# Altium project brushless_foc.PrjPCB
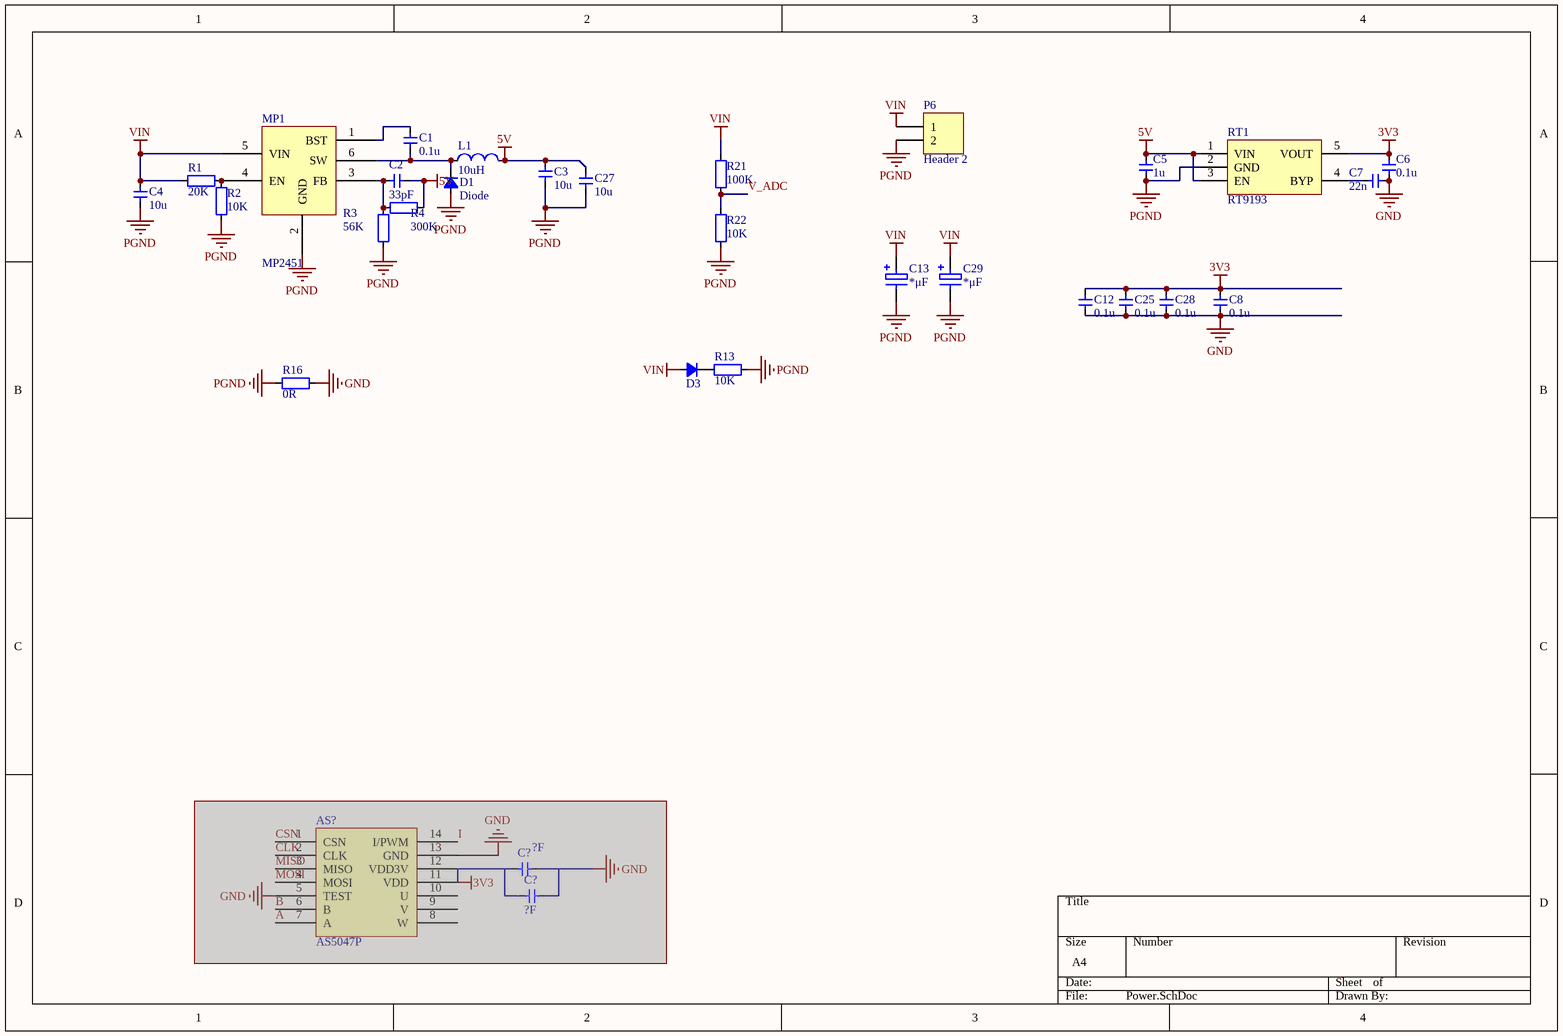
[diagram p0: Power.SchDoc]
4 sheets, 95 parts. Net scope: global (net labels, ports and power ports of the same name join across sheets).
Board file: FocPCB.PcbDoc
Sheets:
  Power.SchDoc
  MCU.SchDoc
  H_Bridge.SchDoc
  GD32MCU.SchDoc

## Sheet Power.SchDoc
size A4

### Parts
(Parts that share a designator on the sheet are numbered #1, #2 ... from top to bottom, then left to right.)
AS?  AS5047P  [AS5047P]  (masked out: inside a compile mask, not in the netlist)
C1  value 0.1u  [CAP_0603]  (hidden comment: Cap_0603)
C2  value 33pF  [CAP_0603]  (hidden comment: Cap_0603)
C3  value 10u  [CAP_0805]  (hidden comment: Cap_0805)
C4  value 10u  [CAP_0805]  (hidden comment: Cap_0805)
C5  value 1u  [CAP_0603]  (hidden comment: Cap_0603)
C6  value 0.1u  [CAP_0603]  (hidden comment: Cap_0603)
C7  value 22n  [CAP_0603]  (hidden comment: Cap_0603)
C8  value 0.1u  [CAP_0603]  (hidden comment: Cap_0603)
C12  value 0.1u  [CAP_0603]  (hidden comment: Cap_0603)
C13  *μF  [CAP-ELE-PIN150/DIA320]
C25  value 0.1u  [CAP_0603]  (hidden comment: Cap_0603)
C27  value 10u  [CAP_0805]  (hidden comment: Cap_0805)
C28  value 0.1u  [CAP_0603]  (hidden comment: Cap_0603)
C29  *μF  [CAP-ELE-PIN150/DIA320]
C?#1  value ?F  [CAP_0603]  (hidden comment: Cap_0603)  (masked out: inside a compile mask, not in the netlist)
C?#2  value ?F  [CAP_0603]  (hidden comment: Cap_0603)  (masked out: inside a compile mask, not in the netlist)
D1  Diode  [LED_0805_RED]
D3  D_0805  [LED_0805_YELLOW]  (value not drawn)
L1  value 10uH  [IND_CD52]  (hidden comment: Ind_CD32)
MP1  MP2451  [SOT23-6]
P6  Header 2  [power]
R1  value 20K  [RES_0603]  (hidden comment: Res_0603)
R2  value 10K  [RES_0603]  (hidden comment: Res_0603)
R3  value 56K  [RES_0603]  (hidden comment: Res_0603)
R4  value 300K  [RES_0603]  (hidden comment: Res_0603)
R13  value 10K  [RES_0603]  (hidden comment: Res_0603)
R16  value 0R  [RES_0603]  (hidden comment: Res_0603)
R21  value 100K  [RES_0603]  (hidden comment: Res_0603)
R22  value 10K  [RES_0603]  (hidden comment: Res_0603)
RT1  RT9193  [SOT23-5]

### Nets
3V3: C6.2 C8.2 C12.2 C25.2 C28.2 RT1.5(VOUT)
5V: C2.1 C3.2 C5.2 C27.2 L1.2 R4.2 RT1.1(VIN) RT1.3(EN)
GND: C6.1 C7.1 C8.1 C12.1 C25.1 C28.1 R16.2
PGND: C3.1 C4.1 C5.1 C13.2 C27.1 C29.2 D1.1(A) MP1.2(GND) P6.2 R2.2 R3.2 R13.2 R16.1 R22.2 RT1.2(GND)
VIN: C4.2 C13.1 C29.1 D3.1(A) MP1.5(VIN) P6.1 R1.1 R21.1
V_ADC: R21.2 R22.1
NetC1_1: C1.1 D1.2(K) L1.1 MP1.6(SW)
NetC1_2: C1.2 MP1.1(BST)
NetC2_2: C2.2 MP1.3(FB) R3.1 R4.1
NetC7_2: C7.2 RT1.4(BYP)
NetD3_2: D3.2(K) R13.1
NetMP1_4: MP1.4(EN) R1.2 R2.1

### Library data of the parts
C1 C2 C5-C8 C12 C25 C28 C?#1 C?#2 = Cap_0603: Capacitor
C3 C4 C27 = Cap_0805: Capacitor
C13 C29 = CAP-ELE: 电解电容; Published: 8-Jun-2000; LatestRevisionDate: 17-Jul-2002; LatestRevisionNote: Re-released for DXP Platform.; PackageReference: RB7.6-15; Publisher: Altium Limited; PackageDescription: Polarized Capacitor (Radial); 2 Leads; Value: *μF
L1 = Ind_CD32: Inductor
P6 = Header 2: Header, 2-Pin; LatestRevisionDate: 17-Jul-2002; LatestRevisionNote: Re-released for DXP Platform.; Publisher: Altium Limited
R1-R4 R13 R16 R21 R22 = Res_0603: Resistor
RT1 = RT9193: Power

## Sheet MCU.SchDoc
size A4
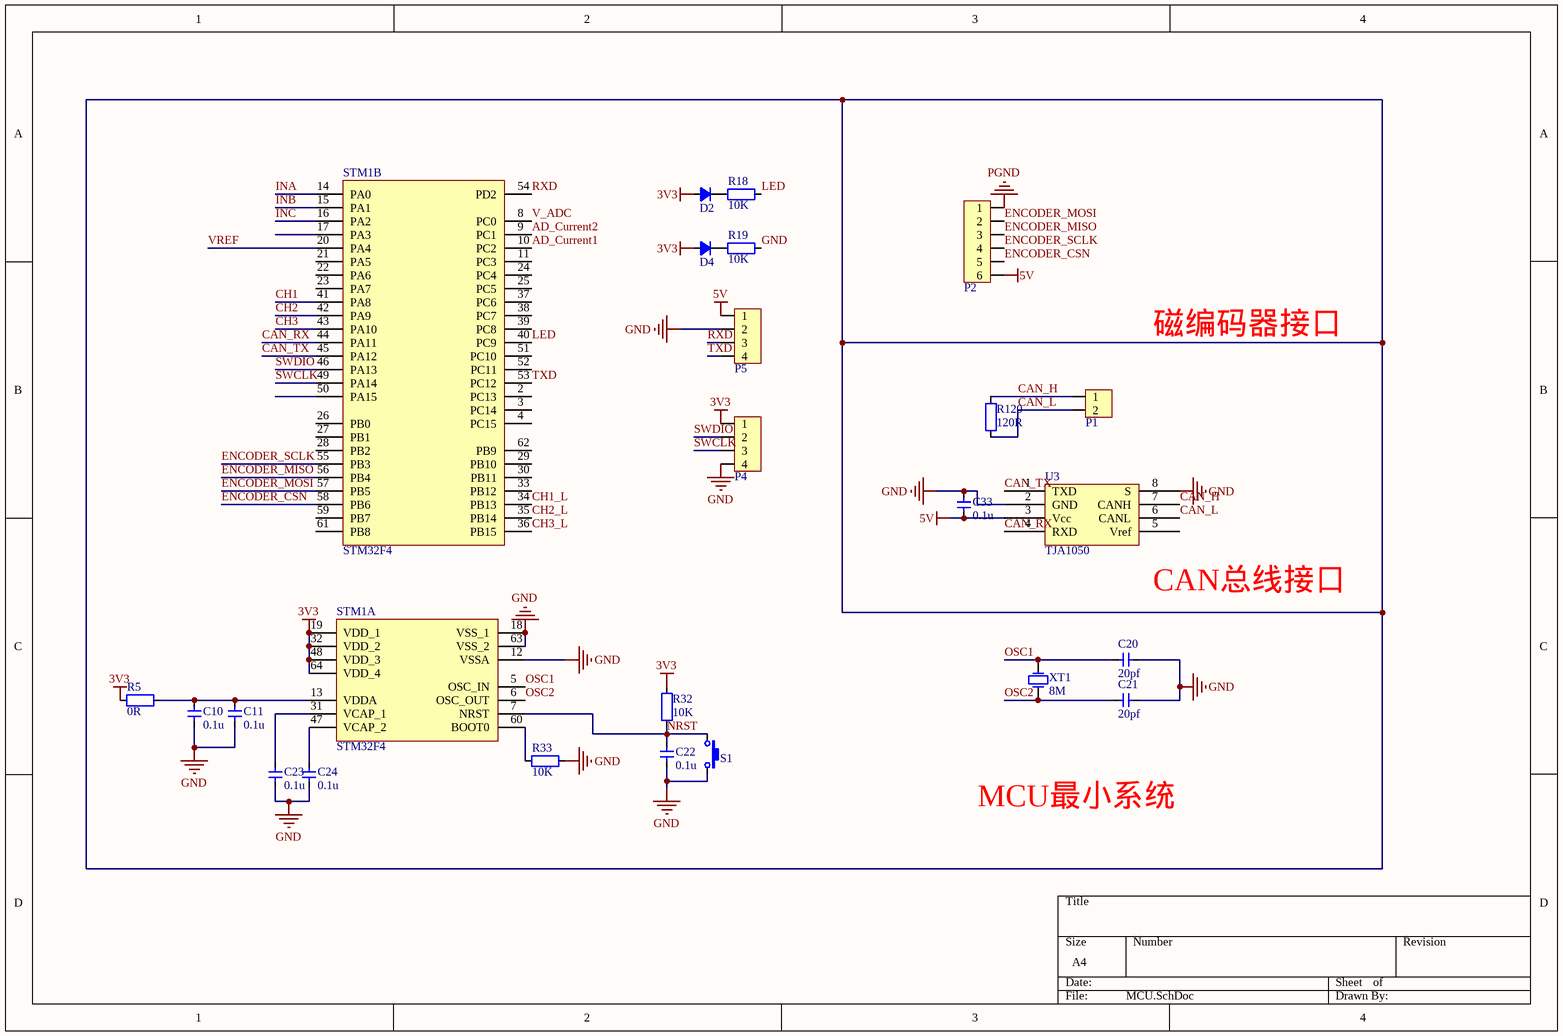
[diagram p1: MCU.SchDoc]

### Parts
C10  value 0.1u  [CAP_0603]  (hidden comment: Cap_0603)
C11  value 0.1u  [CAP_0603]  (hidden comment: Cap_0603)
C20  value 20pf  [CAP_0603]  (hidden comment: Cap_0603)
C21  value 20pf  [CAP_0603]  (hidden comment: Cap_0603)
C22  value 0.1u  [CAP_0603]  (hidden comment: Cap_0603)
C23  value 0.1u  [CAP_0603]  (hidden comment: Cap_0603)
C24  value 0.1u  [CAP_0603]  (hidden comment: Cap_0603)
C33  value 0.1u  [CAP_0603]  (hidden comment: Cap_0603)
D2  D_0805  [LED_0805_YELLOW]  (value not drawn)
D4  D_0805  [LED_0805_YELLOW]  (value not drawn)
P1  HDR1x2_2.54  [HDR1X2_2.54_180]  (value not drawn)
P2  HDR1x6_2.54  [1.25mm_1X6_SMT]  (value not drawn)
P4  HDR1x4_2.54  [HDR1X4_2.54_90]  (value not drawn)
P5  HDR1x4_2.54  [1.25X4_SMT]  (value not drawn)
R5  value 0R  [RES_0603]  (hidden comment: Res_0603)
R18  value 10K  [RES_0603]  (hidden comment: Res_0603)
R19  value 10K  [RES_0603]  (hidden comment: Res_0603)
R32  value 10K  [RES_0603]  (hidden comment: Res_0603)
R33  value 10K  [RES_0603]  (hidden comment: Res_0603)
R120  value 120R  [RES_0603]  (hidden comment: Res_0603)
S1  ButtonTACT_3x4x2_180  [ButtonTACT_3x4x2_180H]  (value not drawn)
STM1  STM32F4  [LQFP_P0.5_64]  (parts A,B of 2)
U3  TJA1050  [SOP_E150_8]
XT1  value 8M  [XT_5032_2]  (hidden comment: XTAL_5032_2P)

### Nets
3V3: D2.1(A) D4.1(A) P4.1 R5.1 R32.1 STM1.19(VDD_1) STM1.32(VDD_2) STM1.48(VDD_3) STM1.64(VDD_4)
5V: C33.1 P2.6 P5.1 U3.3(Vcc)
GND: C10.1 C11.1 C20.1 C21.1 C22.1 C23.2 C24.2 C33.2 P4.4 P5.2 R19.2 R33.2 S1.2 STM1.12(VSSA) STM1.18(VSS_1) STM1.63(VSS_2) U3.2(GND) U3.8(S)
PGND: P2.1
AD_Current1: STM1.10(PC2)
AD_Current2: STM1.9(PC1)
CAN_H: P1.1 R120.1 U3.7(CANH)
CAN_L: P1.2 R120.2 U3.6(CANL)
CAN_RX: STM1.44(PA11) U3.4(RXD)
CAN_TX: STM1.45(PA12) U3.1(TXD)
CH1: STM1.41(PA8)
CH1_L: STM1.34(PB13)
CH2: STM1.42(PA9)
CH2_L: STM1.35(PB14)
CH3: STM1.43(PA10)
CH3_L: STM1.36(PB15)
ENCODER_CSN: P2.5 STM1.58(PB6)
ENCODER_MISO: P2.3 STM1.56(PB4)
ENCODER_MOSI: P2.2 STM1.57(PB5)
ENCODER_SCLK: P2.4 STM1.55(PB3)
INA: STM1.14(PA0)
INB: STM1.15(PA1)
INC: STM1.16(PA2)
LED: R18.2 STM1.40(PC9)
NRST: C22.2 R32.2 S1.1 STM1.7(NRST)
OSC1: C20.2 STM1.5(OSC_IN) XT1.2(OSC2)
OSC2: C21.2 STM1.6(OSC_OUT) XT1.1(OSC1)
RXD: P5.3 STM1.54(PD2)
SWCLK: P4.3 STM1.49(PA14)
SWDIO: P4.2 STM1.46(PA13)
TXD: P5.4 STM1.53(PC12)
V_ADC: STM1.8(PC0)
VREF: STM1.20(PA4)
NetC10_2: C10.2 C11.2 R5.2 STM1.13(VDDA)
NetC23_1: C23.1 STM1.31(VCAP_1)
NetC24_1: C24.1 STM1.47(VCAP_2)
NetD2_2: D2.2(K) R18.1
NetD4_2: D4.2(K) R19.1
NetR33_1: R33.1 STM1.60(BOOT0)

Not connected (* = marked no-connect by the designer): STM1 2(PC13) 3(PC14) 4(PC15) 11(PC3) 17(PA3) 21(PA5) 22(PA6) 23(PA7) 24(PC4) 25(PC5) 26(PB0) 27(PB1) 28(PB2) 29(PB10) 30(PB11) 33(PB12) 37(PC6) 38(PC7) 39(PC8) 50(PA15) 51(PC10) 52(PC11) 59(PB7) 61(PB8) 62(PB9); U3 5(Vref)

### Notes on the sheet
- 磁编码器接口
- (near U3) CAN总线接口
- MCU最小系统

### Library data of the parts
C10 C11 C20-C24 C33 = Cap_0603: Capacitor
P1 = HDR1x2_2.54: Header
P2 = HDR1x6_2.54T: Header
P4 P5 = HDR1x4_2.54: Header
R5 R18 R19 R32 R33 R120 = Res_0603: Resistor
S1 = ButtonTACT_3x4x2_180: Button
STM1 = STM32F405R: MCU
XT1 = XTAL_5032_2P: Crystal Oscillator

## Sheet H_Bridge.SchDoc
size A4
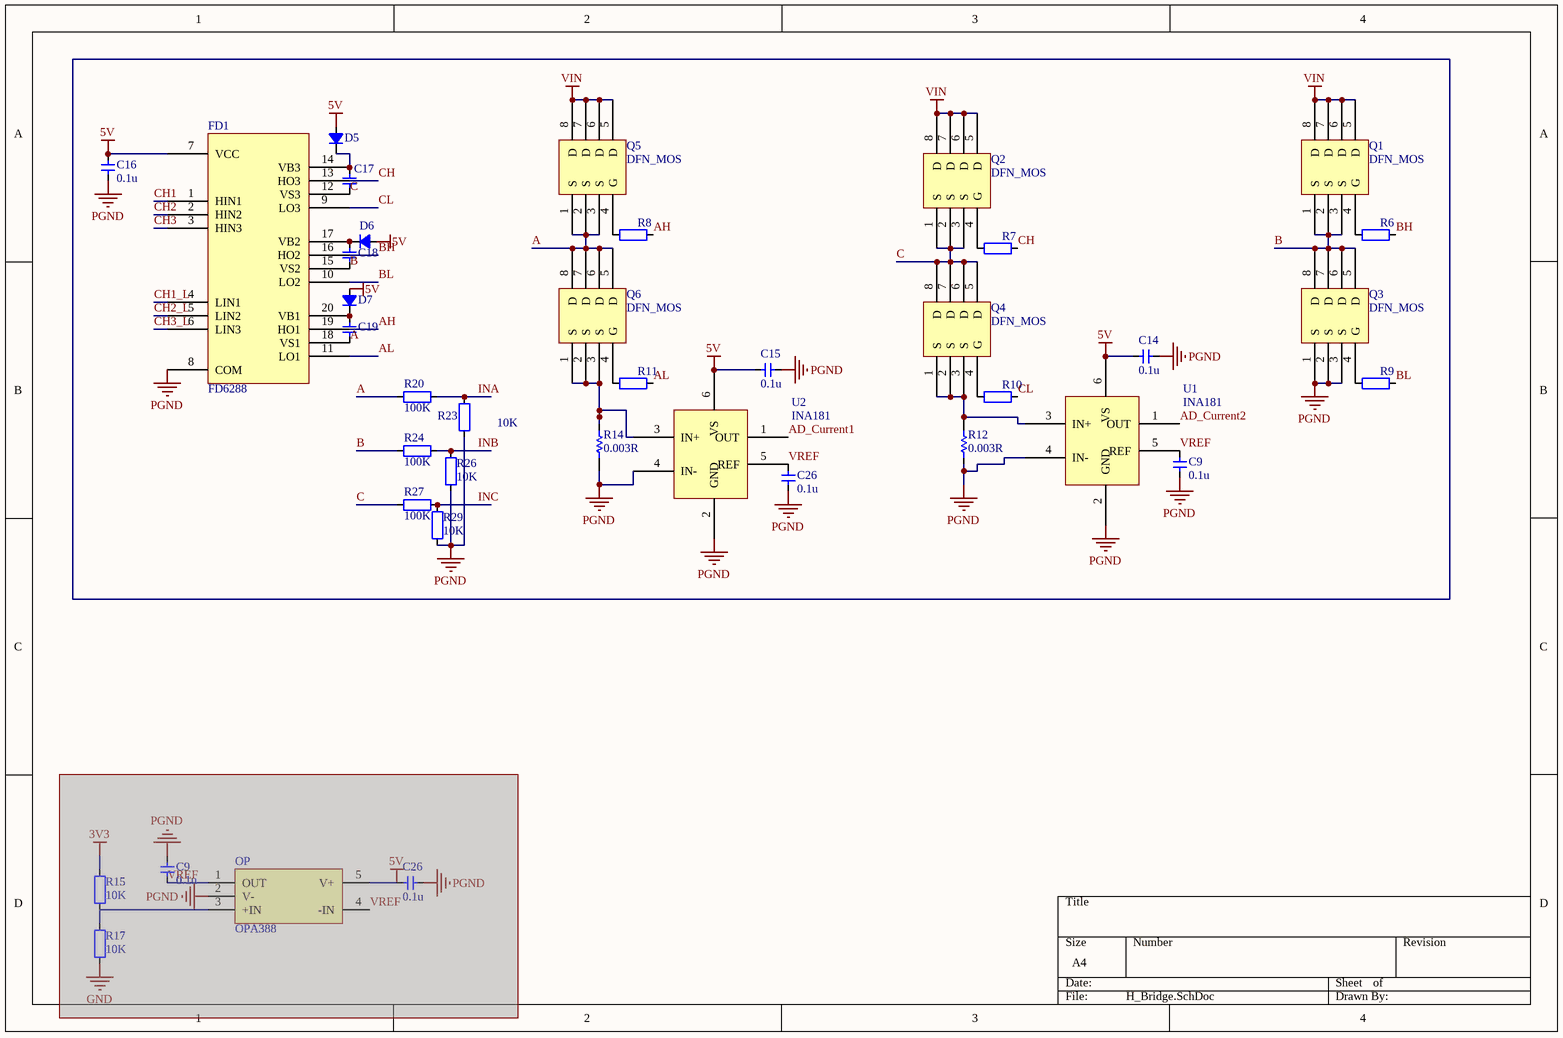
[diagram p2: H_Bridge.SchDoc]

### Parts
(Parts that share a designator on the sheet are numbered #1, #2 ... from top to bottom, then left to right.)
C9#1  value 0.1u  [CAP_0603]  (hidden comment: Cap_0603)
C9#2  value 0.1u  [CAP_0603]  (hidden comment: Cap_0603)  (masked out: inside a compile mask, not in the netlist)
C14  value 0.1u  [CAP_0603]  (hidden comment: Cap_0603)
C15  value 0.1u  [CAP_0603]  (hidden comment: Cap_0603)
C16  value 0.1u  [CAP_0603]  (hidden comment: Cap_0603)
C17  Cap_0603  [CAP_0603]  (value not drawn)
C18  Cap_0603  [CAP_0603]  (value not drawn)
C19  Cap_0603  [CAP_0603]  (value not drawn)
C26#1  value 0.1u  [CAP_0603]  (hidden comment: Cap_0603)
C26#2  value 0.1u  [CAP_0603]  (hidden comment: Cap_0603)  (masked out: inside a compile mask, not in the netlist)
D5  D_0805  [LED_0805_YELLOW]  (value not drawn)
D6  D_0805  [LED_0805_YELLOW]  (value not drawn)
D7  D_0805  [LED_0805_YELLOW]  (value not drawn)
FD1  FD6288  [TSSOP_E170_P0.65_20]
OP  OPA388  [SOT23-5]  (masked out: inside a compile mask, not in the netlist)
Q1  DFN_MOS  [DFN3X3X8]
Q2  DFN_MOS  [DFN3X3X8]
Q3  DFN_MOS  [DFN3X3X8]
Q4  DFN_MOS  [DFN3X3X8]
Q5  DFN_MOS  [DFN3X3X8]
Q6  DFN_MOS  [DFN3X3X8]
R6  Res_0603  [RES_0603]  (value not drawn)
R7  Res_0603  [RES_0603]  (value not drawn)
R8  Res_0603  [RES_0603]  (value not drawn)
R9  Res_0603  [RES_0603]  (value not drawn)
R10  Res_0603  [RES_0603]  (value not drawn)
R11  Res_0603  [RES_0603]  (value not drawn)
R12  value 0.003R  [RES-1206]  (hidden comment: Res1)
R14  value 0.003R  [RES-1206]  (hidden comment: Res1)
R15  value 10K  [RES_0603]  (hidden comment: Res_0603)  (masked out: inside a compile mask, not in the netlist)
R17  value 10K  [RES_0603]  (hidden comment: Res_0603)  (masked out: inside a compile mask, not in the netlist)
R20  value 100K  [RES_0603]  (hidden comment: Res_0603)
R23  value 10K  [RES_0603]  (hidden comment: Res_0603)
R24  value 100K  [RES_0603]  (hidden comment: Res_0603)
R26  value 10K  [RES_0603]  (hidden comment: Res_0603)
R27  value 100K  [RES_0603]  (hidden comment: Res_0603)
R29  value 10K  [RES_0603]  (hidden comment: Res_0603)
U1  INA181  [SOT23-6]
U2  INA181  [SOT23-6]

### Nets
5V: C14.2 C15.2 C16.2 D5.1(A) D6.1(A) D7.1(A) FD1.7(VCC) U1.6(VS) U2.6(VS)
PGND: C9#1.2 C14.1 C15.1 C16.1 C26#1.2 FD1.8(COM) Q3.1(S) Q3.2(S) Q3.3(S) R12.1 R14.1 R23.1 R26.1 R29.1 U1.2(GND) U1.4(IN-) U2.2(GND) U2.4(IN-)
VIN: Q1.5(D) Q1.6(D) Q1.7(D) Q1.8(D) Q2.5(D) Q2.6(D) Q2.7(D) Q2.8(D) Q5.5(D) Q5.6(D) Q5.7(D) Q5.8(D)
A: C19.2 FD1.18(VS1) Q5.1(S) Q5.2(S) Q5.3(S) Q6.5(D) Q6.6(D) Q6.7(D) Q6.8(D) R20.1
AD_Current1: U2.1(OUT)
AD_Current2: U1.1(OUT)
AH: FD1.19(HO1) R8.2
AL: FD1.11(LO1) R11.2
B: C18.2 FD1.15(VS2) Q1.1(S) Q1.2(S) Q1.3(S) Q3.5(D) Q3.6(D) Q3.7(D) Q3.8(D) R24.1
BH: FD1.16(HO2) R6.2
BL: FD1.10(LO2) R9.2
C: C17.2 FD1.12(VS3) Q2.1(S) Q2.2(S) Q2.3(S) Q4.5(D) Q4.6(D) Q4.7(D) Q4.8(D) R27.1
CH: FD1.13(HO3) R7.2
CH1: FD1.1(HIN1)
CH1_L: FD1.4(LIN1)
CH2: FD1.2(HIN2)
CH2_L: FD1.5(LIN2)
CH3: FD1.3(HIN3)
CH3_L: FD1.6(LIN3)
CL: FD1.9(LO3) R10.2
INA: R20.2 R23.2
INB: R24.2 R26.2
INC: R27.2 R29.2
VREF: C9#1.1 C26#1.1 U1.5(REF) U2.5(REF)
NetC17_1: C17.1 D5.2(K) FD1.14(VB3)
NetC18_1: C18.1 D6.2(K) FD1.17(VB2)
NetC19_1: C19.1 D7.2(K) FD1.20(VB1)
NetQ1_4: Q1.4(G) R6.1
NetQ2_4: Q2.4(G) R7.1
NetQ3_4: Q3.4(G) R9.1
NetQ4_1: Q4.1(S) Q4.2(S) Q4.3(S) R12.2 U1.3(IN+)
NetQ4_4: Q4.4(G) R10.1
NetQ5_4: Q5.4(G) R8.1
NetQ6_1: Q6.1(S) Q6.2(S) Q6.3(S) R14.2 U2.3(IN+)
NetQ6_4: Q6.4(G) R11.1

### Library data of the parts
C9#1 C9#2 C14-C16 C26#1 C26#2 = Cap_0603: Capacitor
C17-C19 = Cap_0603: Capacitor; Value: 1u
OP = OPA188: OP
R6-R11 = Res_0603: Resistor; Value: 10R
R12 R14 = Res1: Resistor; Published: 8-Jun-2000; LatestRevisionDate: 17-Jul-2002; LatestRevisionNote: Re-released for DXP Platform.; PackageReference: AXIAL-0.3; Publisher: Altium Limited
R15 R17 R20 R23 R24 R26 R27 R29 = Res_0603: Resistor

## Sheet GD32MCU.SchDoc
size A4
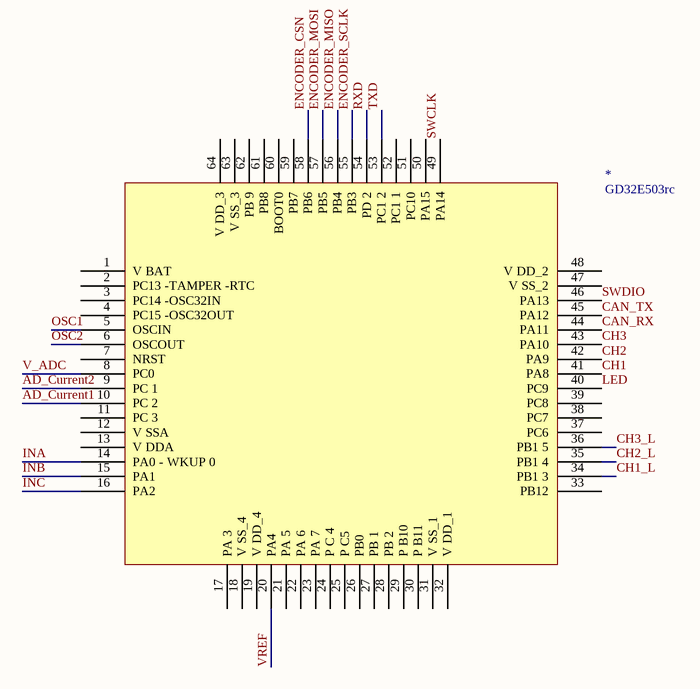
[diagram p3: GD32MCU.SchDoc]

### Parts
*  GD32E503rc  [LQFP_P0.5_64]

### Nets
AD_Current1: *.10(PC_2)
AD_Current2: *.9(PC_1)
CAN_RX: *.44(PA11)
CAN_TX: *.45(PA12)
CH1: *.41(PA8)
CH1_L: *.34(PB1_3)
CH2: *.42(PA9)
CH2_L: *.35(PB1_4)
CH3: *.43(PA10)
CH3_L: *.36(PB1_5)
ENCODER_CSN: *.58(PB6)
ENCODER_MISO: *.56(PB4)
ENCODER_MOSI: *.57(PB5)
ENCODER_SCLK: *.55(PB3)
INA: *.14(PA0_-_WKUP_0)
INB: *.15(PA1)
INC: *.16(PA2)
LED: *.40(PC9)
OSC1: *.5(OSCIN)
OSC2: *.6(OSCOUT)
RXD: *.54(PD_2)
SWCLK: *.49(PA14)
SWDIO: *.46(PA13)
TXD: *.53(PC1_2)
V_ADC: *.8(PC0)
VREF: *.20(PA4)

Not connected (* = marked no-connect by the designer): * 1(V_BAT) 2(PC13_-TAMPER_-RTC) 3(PC14_-OSC32IN) 4(PC15_-OSC32OUT) 7(NRST) 11(PC_3) 12(V_SSA) 13(V_DDA) 17(PA_3) 18(V_SS_4) 19(V_DD_4) 21(PA_5) 22(PA_6) 23(PA_7) 24(P_C_4) 25(P_C5) 26(PB0) 27(PB_1) 28(PB_2) 29(P_B10) 30(P_B11) 31(V_SS_1) 32(V_DD_1) 33(PB12) 37(PC6) 38(PC7) 39(PC8) 47(V_SS_2) 48(V_DD_2) 50(PA15) 51(PC10) 52(PC1_1) 59(PB7) 60(BOOT0) 61(PB8) 62(PB_9) 63(V_SS_3) 64(V_DD_3)

## Nets that join several sheets
3V3: Power (6 pins), MCU (9 pins)
5V: Power (8 pins), MCU (C33.1 P2.6 P5.1 U3.3), H_Bridge (9 pins)
GND: Power (7 pins), MCU (18 pins)
PGND: Power (15 pins), MCU (P2.1), H_Bridge (18 pins)
VIN: Power (8 pins), H_Bridge (12 pins)
AD_Current1: MCU (STM1.10), H_Bridge (U2.1), GD32MCU (*.10)
AD_Current2: MCU (STM1.9), H_Bridge (U1.1), GD32MCU (*.9)
CAN_RX: MCU (STM1.44 U3.4), GD32MCU (*.44)
CAN_TX: MCU (STM1.45 U3.1), GD32MCU (*.45)
CH1: MCU (STM1.41), H_Bridge (FD1.1), GD32MCU (*.41)
CH1_L: MCU (STM1.34), H_Bridge (FD1.4), GD32MCU (*.34)
CH2: MCU (STM1.42), H_Bridge (FD1.2), GD32MCU (*.42)
CH2_L: MCU (STM1.35), H_Bridge (FD1.5), GD32MCU (*.35)
CH3: MCU (STM1.43), H_Bridge (FD1.3), GD32MCU (*.43)
CH3_L: MCU (STM1.36), H_Bridge (FD1.6), GD32MCU (*.36)
ENCODER_CSN: MCU (P2.5 STM1.58), GD32MCU (*.58)
ENCODER_MISO: MCU (P2.3 STM1.56), GD32MCU (*.56)
ENCODER_MOSI: MCU (P2.2 STM1.57), GD32MCU (*.57)
ENCODER_SCLK: MCU (P2.4 STM1.55), GD32MCU (*.55)
INA: MCU (STM1.14), H_Bridge (R20.2 R23.2), GD32MCU (*.14)
INB: MCU (STM1.15), H_Bridge (R24.2 R26.2), GD32MCU (*.15)
INC: MCU (STM1.16), H_Bridge (R27.2 R29.2), GD32MCU (*.16)
LED: MCU (R18.2 STM1.40), GD32MCU (*.40)
OSC1: MCU (C20.2 STM1.5 XT1.2), GD32MCU (*.5)
OSC2: MCU (C21.2 STM1.6 XT1.1), GD32MCU (*.6)
RXD: MCU (P5.3 STM1.54), GD32MCU (*.54)
SWCLK: MCU (P4.3 STM1.49), GD32MCU (*.49)
SWDIO: MCU (P4.2 STM1.46), GD32MCU (*.46)
TXD: MCU (P5.4 STM1.53), GD32MCU (*.53)
V_ADC: Power (R21.2 R22.1), MCU (STM1.8), GD32MCU (*.8)
VREF: MCU (STM1.20), H_Bridge (C9#1.1 C26#1.1 U1.5 U2.5), GD32MCU (*.20)